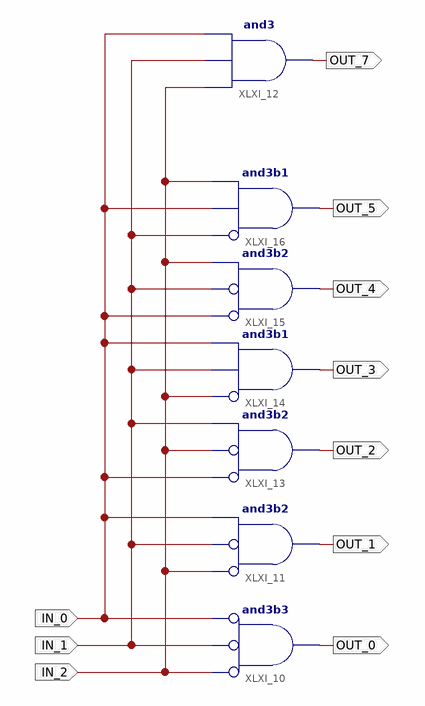
[diagram p0: schematic sheet 1]
// Xilinx ISE schematic My3to7Decoder.sch (spartan3a) as structural Verilog: 7 symbols, 10 ports
module My3to7Decoder (
  input  IN_0,
  input  IN_1,
  input  IN_2,
  output OUT_0,
  output OUT_1,
  output OUT_2,
  output OUT_3,
  output OUT_4,
  output OUT_7,
  output OUT_5
);

  and XLXI_10 (OUT_0, ~IN_0, ~IN_1, ~IN_2);  // and3b3
  and XLXI_11 (OUT_1, ~IN_2, ~IN_1, IN_0);  // and3b2
  and XLXI_12 (OUT_7, IN_2, IN_1, IN_0);
  and XLXI_13 (OUT_2, ~IN_0, ~IN_2, IN_1);  // and3b2
  and XLXI_14 (OUT_3, ~IN_2, IN_1, IN_0);  // and3b1
  and XLXI_15 (OUT_4, ~IN_0, ~IN_1, IN_2);  // and3b2
  and XLXI_16 (OUT_5, ~IN_1, IN_0, IN_2);  // and3b1
endmodule
